# EasyEDA Pro project New Project_2025-05-17_15-31-49.eprj

# Schematic Schematic1
Board Name: Board1; Create Date: 2025-05-17; Page Name: P1; Project Name: New Project_2025-05-17_15-31-49; Schematic Name: Schematic1; Update Date: 2025-05-17; Company: 嘉立创EDA; Page Size: A4; Version: V1.0
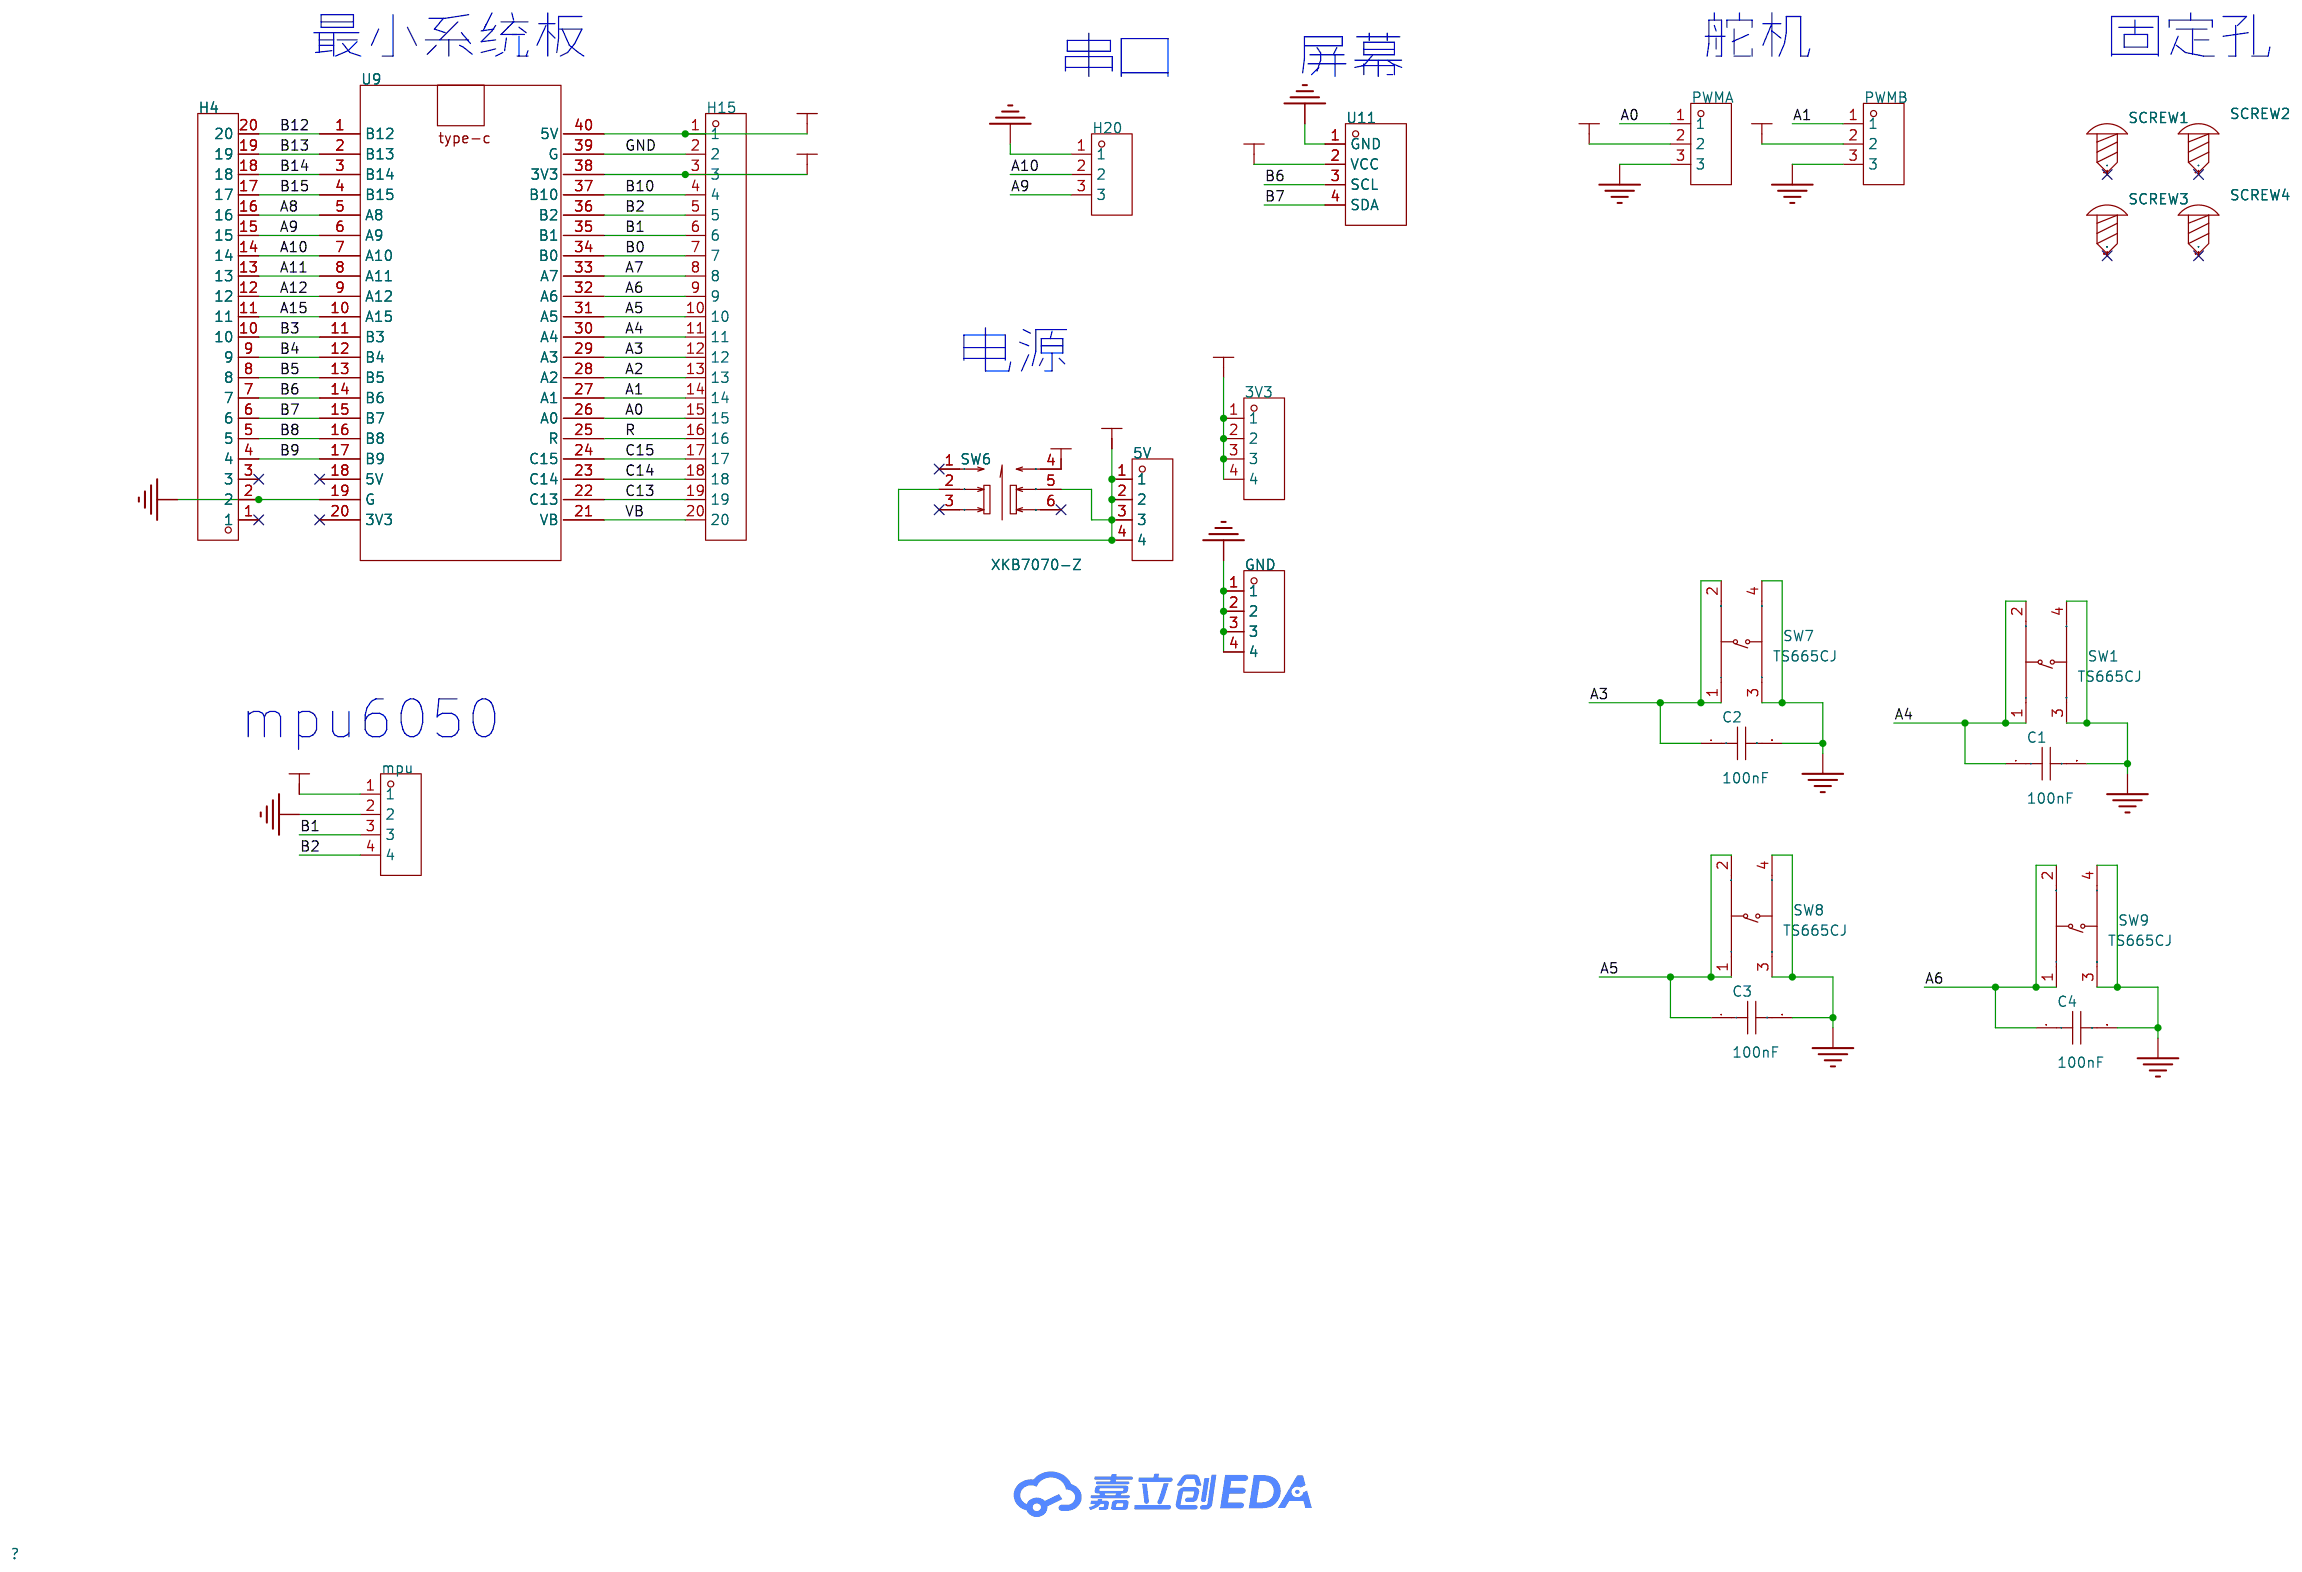
[diagram p0: schematic sheet]

## Parts
3V3  -  [HDR-TH_4P-P2.54-V-M]
5V  -  [HDR-TH_4P-P2.54-V-M]
C1  100nF  [CAP-TH_L5.0-W2.5-P5.00-D1.0]
C2  100nF  [CAP-TH_L5.0-W2.5-P5.00-D1.0]
C3  100nF  [CAP-TH_L5.0-W2.5-P5.00-D1.0]
C4  100nF  [CAP-TH_L5.0-W2.5-P5.00-D1.0]
GND  -  [HDR-TH_4P-P2.54-V-M]
H4  -  [HDR-TH_20P-P2.54-V-M-1]
H15  -  [HDR-TH_20P-P2.54-V-M-1]
H20  -  [HDR-TH_3P-P2.54-V-M]
mpu  -  [HDR-TH_4P-P2.54-V-F]
PWMA  -  [HDR-TH_3P-P2.54-V-M]
PWMB  -  [HDR-TH_3P-P2.54-V-M]
SCREW1  -  [M3螺丝]
SCREW2  -  [M3螺丝]
SCREW3  -  [M3螺丝]
SCREW4  -  [M3螺丝]
SW1  TS665CJ  [SW-TH_4P-L6.0-W6.0-P4.50-LS6.5]
SW6  XKB7070-Z  [SW-TH_6P-L7.0-W7.0-P2.00]
SW7  TS665CJ  [SW-TH_4P-L6.0-W6.0-P4.50-LS6.5]
SW8  TS665CJ  [SW-TH_4P-L6.0-W6.0-P4.50-LS6.5]
SW9  TS665CJ  [SW-TH_4P-L6.0-W6.0-P4.50-LS6.5]
U9  -  [F401CCU6]
U11  HS96L03W2C03  [OLED-TH_L27.8-W27.2-P2.54_C9900033791]

## Library data of the parts
3V3 5V GND = HDR-M_2.54_1x4P: Supplier Part: C492403; Supplier Footprint: 插件
C1-C4 = CC1H104MC1FD3F6C10MF: 容值:100nF;精度:±20%;额定电压:50V;温度系数:Y5V;; LCSC Part Name: 100nF ±20% 50V; Supplier Part: C254085; Manufacturer: Dersonic(德尔创); Supplier Footprint: 插件,P=5.08mm; JLCPCB Part Class: 扩展库; Datasheet: https://atta.szlcsc.com/upload/public/pdf/source/20200826/C254085_159DD65BF32BF11C9168D341BCE23E6F.pdf; Supplier: LCSC; Tolerance: ±20%; Voltage Rating: 50V; Pin Spacing: 5.08mm; Temperature Coefficient: Y5V; Diameter: 6mm; Body Thickness: 2.2mm
H4 H15 = HDR-M_2.54_1x20P: 间距:2.54mm;总PIN位数:20;排数:1;插针结构:-;行距:-;安装类型:直插;圆针/方针:-;额定电流:-;额定电压:-;配合针长度:-;塑高:-;触头材质:黄铜;触头镀层:-;颜色:黑色;; Supplier Part: C50981; Supplier Footprint: 插件
H20 PWMA PWMB = HDR-M_2.54_1x3P: Supplier Part: C2937625; Supplier Footprint: 插件
mpu = HDR-F_2.54_1x4P: Supplier Part: C2718488; Supplier Footprint: 插件
SCREW1-SCREW4 = M3螺丝: Supplier Footprint: 插件
SW1 SW7-SW9 = TS665CJ: 电路结构:单刀单掷;按钮形状:圆形按钮;安装方式:直插;开关长度:6mm;开关宽度:6mm;开关高度:5mm;触点电流:50mA;额定电压(DC):12V;带灯:-;机械寿命:-;; LCSC Part Name: 6*6*5mm 直插 轻触开关; Supplier Part: C393938; Manufacturer: SHOU HAN(首韩); Supplier Footprint: 插件; JLCPCB Part Class: 扩展库; Datasheet: https://atta.szlcsc.com/upload/public/pdf/source/20190521/C393938_BDABEAC600B4C55E200A80AA129B70BC.pdf; Supplier: LCSC; Circuit: 单刀单掷; Actuator Style: 圆形按钮; Mounting Style: 直插; Switch Length: 6mm; Switch Width: 6mm; Switch Height: 5mm; Contact Current: 50mA; Voltage Rating (DC): 12V
SW6 = XKB7070-Z: 自锁/无锁:自锁;安装方式:直插;触点电流:100mA;额定电压 (AC):250V;额定电压 (DC):30V;带灯:不带;作用力:160gf;机械寿命:10万次;; LCSC Part Name: 按键开关   7*7插件自锁 蓝白黑; Supplier Part: C318863; Manufacturer: XKB Connectivity(中国星坤); Supplier Footprint: 插件; Datasheet: https://atta.szlcsc.com/upload/public/pdf/source/20211015/75A682A27A424BDE8D93C2CFA14C38FE.pdf; Supplier: LCSC; Self Lock / No Lock: 自锁; Actuator Style: 矩形按钮; Mounting Style: 直插; Contact Current: 100mA; Voltage Rating (AC): 250V; Voltage Rating (DC): 30V; Insulation Resistance: 100MΩ; Actuator/Cap Color: 蓝色; With Lamp: 不带; Pin Style: PC引脚; Operating Force: 160gf; Operating Temperature: -15℃~+55℃; Mechanical Life: 10万次
U9 = F401CCU6
U11 = HS96L03W2C03: 主控芯片:SSD1315;接口类型:I2C;尺寸(inch):0.96;像素分辨率:128x64;; LCSC Part Name: 0.96寸OLED显示屏窄白光IIC; Supplier Part: C5248080; Manufacturer: HS(汉昇); JLCPCB Part Class: 扩展库; Datasheet: https://atta.szlcsc.com/upload/public/pdf/source/20230627/763D01F79A90007632F098068C7C8AD9.pdf; Supplier: LCSC; Main Control Chip: SSD1315; Interface Type: I2C; Size: 0.96; Pixel Resolution: 128x64; Operating Temperature: -40℃~+70℃

## Nets
3V3: 3V3.1 3V3.2 3V3.3 3V3.4 H15.3 U9.38(3V3) U11.2(VCC)
5V: 5V.1 5V.2 5V.3 5V.4 H15.1 mpu.1 PWMA.2 PWMB.2 SW6.2 SW6.4 SW6.5 U9.40(5V)
GND: C1.2 C2.2 C3.2 C4.2 GND.1 GND.2 GND.3 GND.4 H4.2 H15.2 H20.1 mpu.2 PWMA.3 PWMB.3 SW1.3(C) SW1.4(D) SW7.3(C) SW7.4(D) SW8.3(C) SW8.4(D) SW9.3(C) SW9.4(D) U9.19(G) U9.39(G) U11.1(GND)
A0: H15.15 PWMA.1 U9.26(A0)
A1: H15.14 PWMB.1 U9.27(A1)
A2: H15.13 U9.28(A2)
A3: C2.1 H15.12 SW7.1(A) SW7.2(B) U9.29(A3)
A4: C1.1 H15.11 SW1.1(A) SW1.2(B) U9.30(A4)
A5: C3.1 H15.10 SW8.1(A) SW8.2(B) U9.31(A5)
A6: C4.1 H15.9 SW9.1(A) SW9.2(B) U9.32(A6)
A7: H15.8 U9.33(A7)
A8: H4.16 U9.5(A8)
A9: H4.15 H20.3 U9.6(A9)
A10: H4.14 H20.2 U9.7(A10)
A11: H4.13 U9.8(A11)
A12: H4.12 U9.9(A12)
A15: H4.11 U9.10(A15)
B0: H15.7 U9.34(B0)
B1: H15.6 mpu.3 U9.35(B1)
B2: H15.5 mpu.4 U9.36(B2)
B3: H4.10 U9.11(B3)
B4: H4.9 U9.12(B4)
B5: H4.8 U9.13(B5)
B6: H4.7 U9.14(B6) U11.3(SCL)
B7: H4.6 U9.15(B7) U11.4(SDA)
B8: H4.5 U9.16(B8)
B9: H4.4 U9.17(B9)
B10: H15.4 U9.37(B10)
B12: H4.20 U9.1(B12)
B13: H4.19 U9.2(B13)
B14: H4.18 U9.3(B14)
B15: H4.17 U9.4(B15)
C13: H15.19 U9.22(C13)
C14: H15.18 U9.23(C14)
C15: H15.17 U9.24(C15)
R: H15.16 U9.25(R)
VB: H15.20 U9.21(VB)

Not connected (* = marked no-connect by the designer): H4 1* 3*; SCREW1 1*; SCREW2 1*; SCREW3 1*; SCREW4 1*; SW6 1* 3* 6*; U9 18(5V)* 20(3V3)*

## Notes on the sheet
- 最小系统板
- 舵机
- 固定孔
- 串口
- 屏幕
- 电源
- mpu6050

# Board PCB1
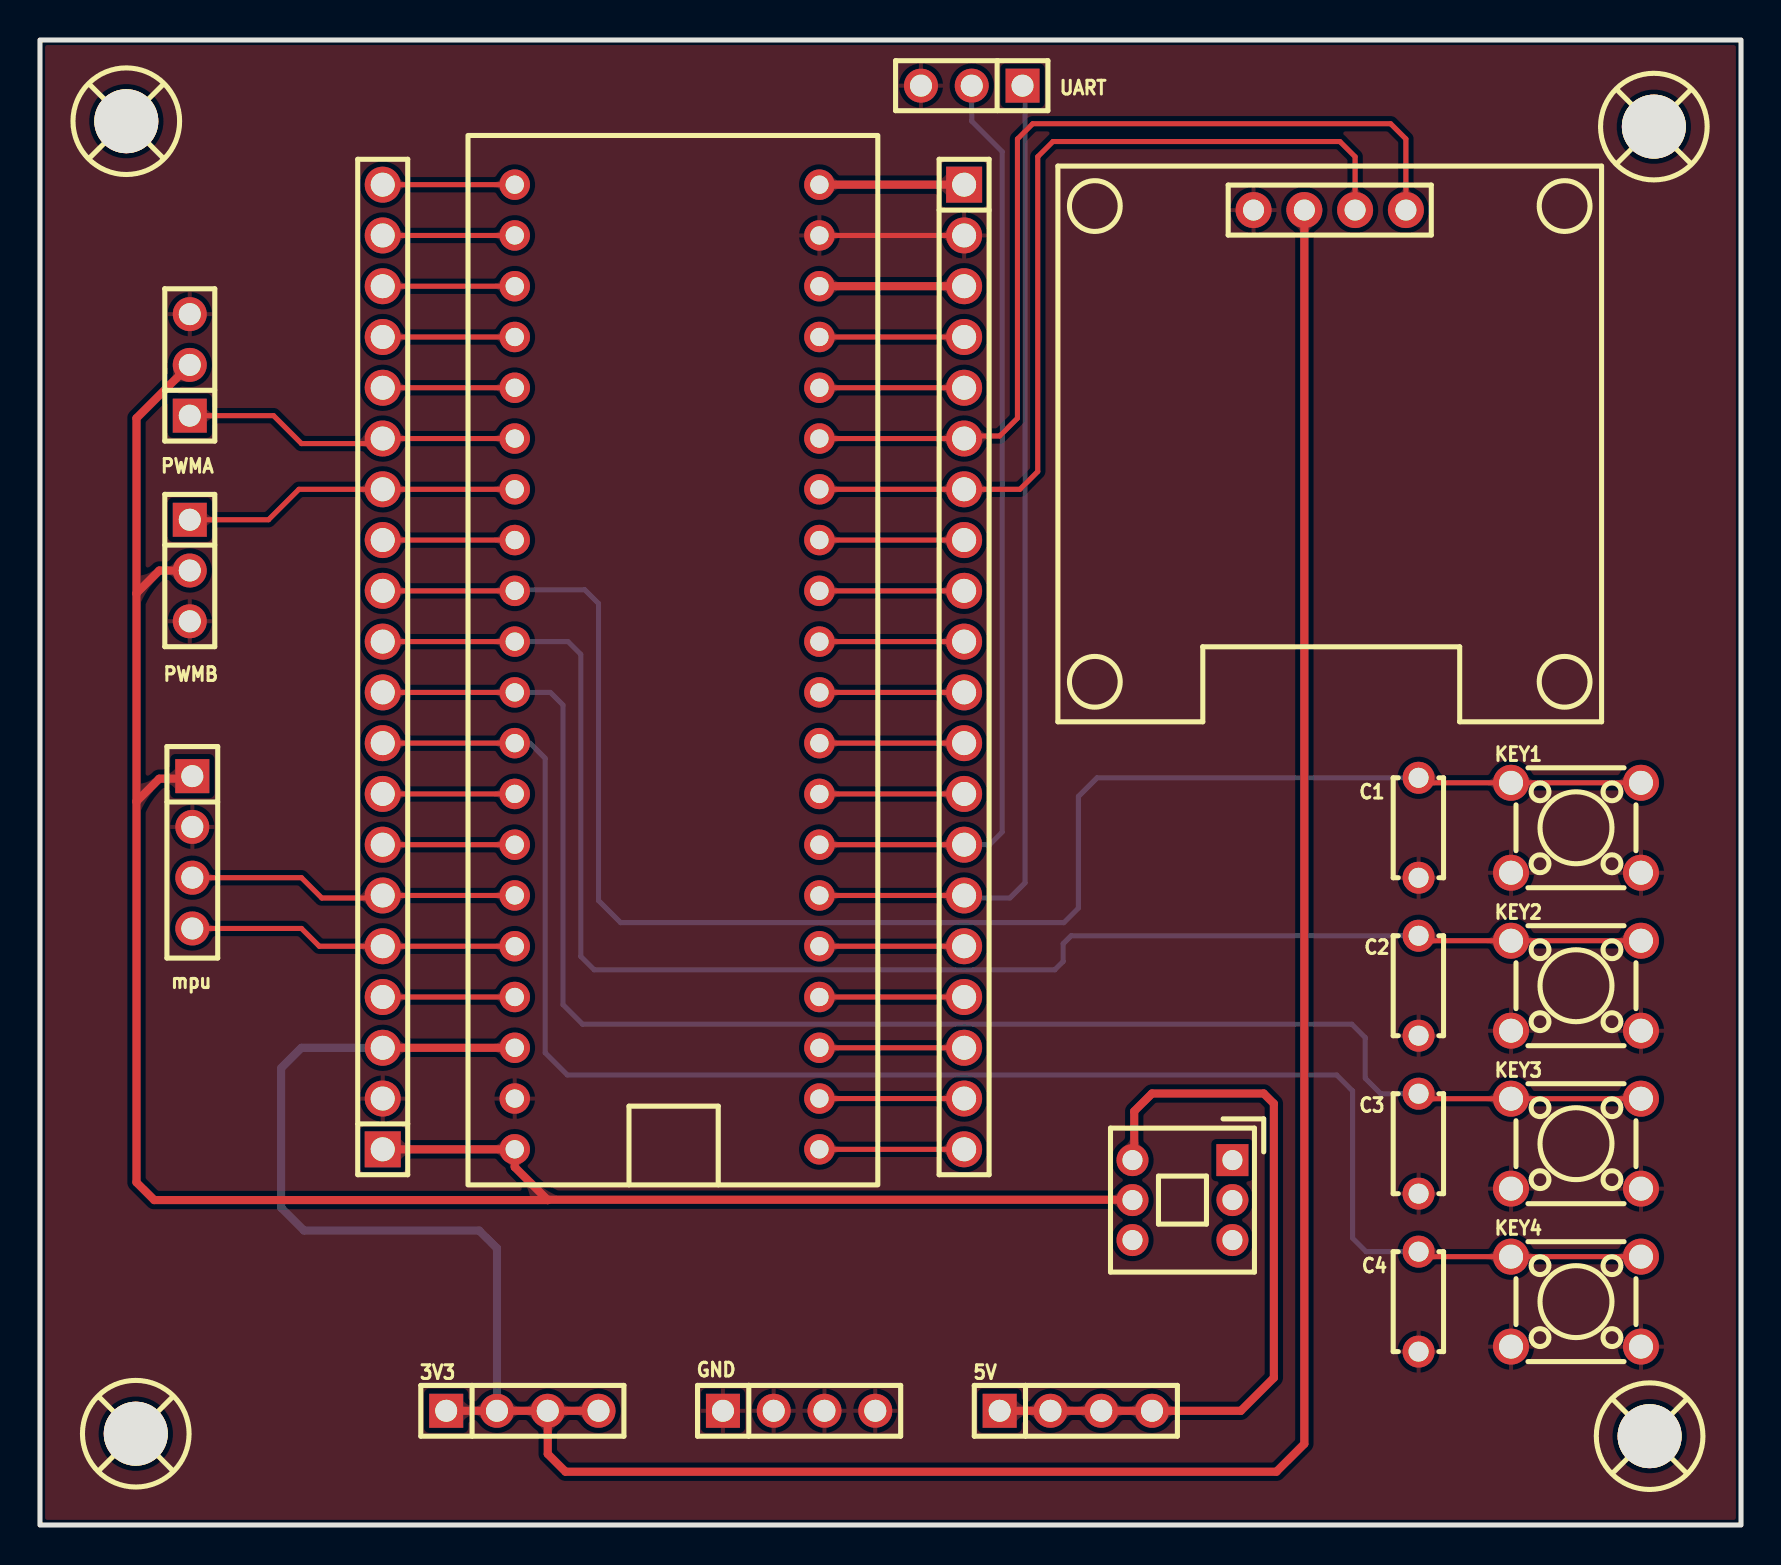
[diagram p1: board, top side]
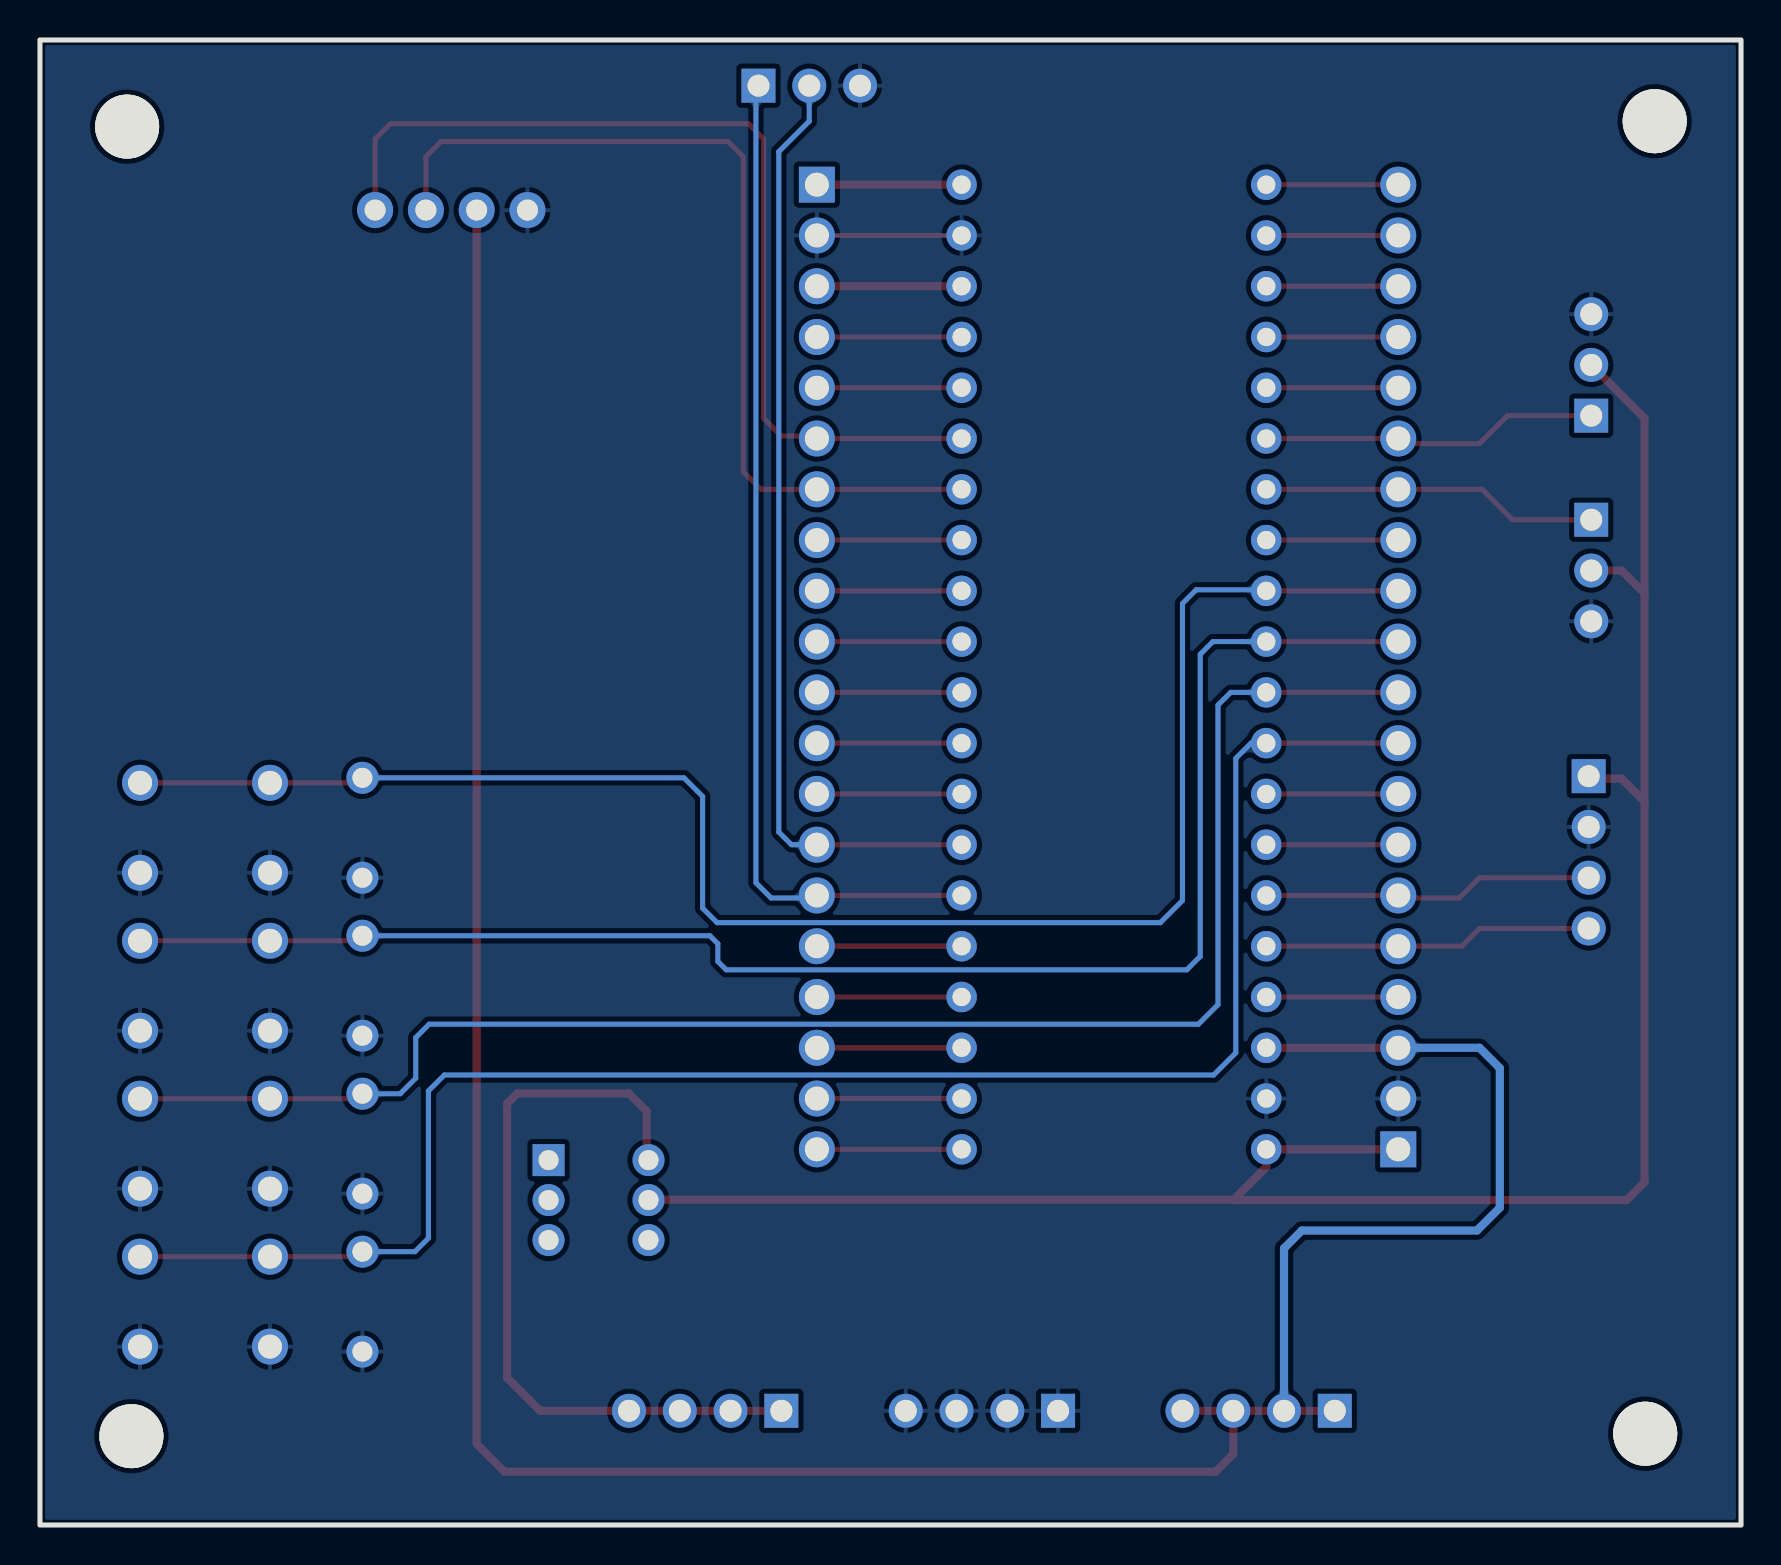
[diagram p2: board, bottom side, seen from below]

Outline 85.09 x 74.3 mm; copper layers: Top Layer, Bottom Layer. Coordinates in mm from the lower left corner of the outline.
Outline path: rectangle 0,74.3 85.09,0
Stack: Top Layer 0.035mm / Dielectric1 1.51mm FR4 er 4.5 / Bottom Layer 0.035mm

## Design rules (mm)
template: JLCPCB Capability(Two Layers Board)
spacing copperThickness1oz (default): track to track 0.102, other pairs 0.152 to 0.3
spacing copperThickness2oz: track to track 0.203, other pairs 0.152 to 0.3
track width copperThickness1oz (default): min 0.127, default 0.254, max 2.54
track width copperThickness2oz: min 0.203, default 0.254, max 2.54
differential pair differentialPair (default): width min 0.127, default 0.254, max 2.54; gap min 0.152, default 0.152
via viaSize (default): diameter min 0.5, default 0.61, max 10; hole min 0.3, default 0.305, max 6.3

## Placement (name value [footprint] x y rotation side)
3V3  -  [HDR-TH_4P-P2.54-V-M]  24.13 5.72 0 top
5V  -  [HDR-TH_4P-P2.54-V-M]  51.82 5.72 0 top
C1  100nF  [CAP-TH_L5.0-W2.5-P5.00-D1.0]  68.96 34.88 270 top
C2  100nF  [CAP-TH_L5.0-W2.5-P5.00-D1.0]  68.96 26.98 270 top
C3  100nF  [CAP-TH_L5.0-W2.5-P5.00-D1.0]  68.96 19.08 270 top
C4  100nF  [CAP-TH_L5.0-W2.5-P5.00-D1.0]  68.96 11.18 270 top
GND  -  [HDR-TH_4P-P2.54-V-M]  37.97 5.72 0 top
H4  -  [HDR-TH_20P-P2.54-V-M-1]  46.23 42.93 270 top
H15  -  [HDR-TH_20P-P2.54-V-M-1]  17.14 42.93 90 top
KEY1  TS665CJ  [SW-TH_4P-L6.0-W6.0-P4.50-LS6.5]  76.83 34.88 0 top
KEY2  TS665CJ  [SW-TH_4P-L6.0-W6.0-P4.50-LS6.5]  76.83 26.98 0 top
KEY3  TS665CJ  [SW-TH_4P-L6.0-W6.0-P4.50-LS6.5]  76.83 19.08 0 top
KEY4  TS665CJ  [SW-TH_4P-L6.0-W6.0-P4.50-LS6.5]  76.83 11.18 0 top
mpu  -  [HDR-TH_4P-P2.54-V-F]  7.62 33.66 270 top
PWMA  -  [HDR-TH_3P-P2.54-V-M]  7.49 58.04 90 top
PWMB  -  [HDR-TH_3P-P2.54-V-M]  7.49 47.75 270 top
SCREW1  -  [M3螺丝]  4.32 70.23 0 top
SCREW2  -  [M3螺丝]  80.73 69.96 0 top
SCREW3  -  [M3螺丝]  4.79 4.57 0 top
SCREW4  -  [M3螺丝]  80.52 4.44 0 top
SW6  XKB7070-Z  [SW-TH_6P-L7.0-W7.0-P2.00]  57.15 16.26 0 top
U9  -  [F401CCU6]  38.99 18.8 180 top
U11  HS96L03W2C03  [OLED-TH_L27.8-W27.2-P2.54_C9900033791]  64.52 65.79 0 top
UART  -  [HDR-TH_3P-P2.54-V-M]  46.61 72.01 180 top

## Footprints (pads in the part's own frame, mm; a bottom-side part is the same pattern mirrored in y, then rotated)
CAP-TH_L5.0-W2.5-P5.00-D1.0
  round 1.6 hole 1: 1(-2.5,0) 2(2.5,0)
F401CCU6
  round 1.524 hole 0.914: 1(0,0) 2(0,-2.54) 3(0,-5.08) 4(0,-7.62) 5(0,-10.16) 6(0,-12.7) 7(0,-15.24) 8(0,-17.78) 9(0,-20.32) 10(0,-22.86) 11(0,-25.4) 12(0,-27.94) 13(0,-30.48) 14(0,-33.02) 15(0,-35.56) 16(0,-38.1) 17(0,-40.64) 18(0,-43.18) 19(0,-45.72) 20(0,-48.26) 21(15.24,-48.26) 22(15.24,-45.72) 23(15.24,-43.18) 24(15.24,-40.64) 25(15.24,-38.1) 26(15.24,-35.56) 27(15.24,-33.02) 28(15.24,-30.48) 29(15.24,-27.94) 30(15.24,-25.4) 31(15.24,-22.86) 32(15.24,-20.32) 33(15.24,-17.78) 34(15.24,-15.24) 35(15.24,-12.7) 36(15.24,-10.16) 37(15.24,-7.62) 38(15.24,-5.08) 39(15.24,-2.54) 40(15.24,0)
HDR-TH_3P-P2.54-V-M
  rect 1.7x1.7 hole 1.1: 1(-2.54,0)
  round 1.7 hole 1.1: 2(0,0) 3(2.54,0)
HDR-TH_4P-P2.54-V-F
  rect 1.7x1.7 hole 1.1: 1(-3.81,0)
  round 1.7 hole 1.1: 2(-1.27,0) 3(1.27,0) 4(3.81,0)
HDR-TH_4P-P2.54-V-M
  rect 1.7x1.7 hole 1.1: 1(-3.81,0)
  round 1.7 hole 1.1: 2(-1.27,0) 3(1.27,0) 4(3.81,0)
HDR-TH_20P-P2.54-V-M-1
  rect 1.8x1.8 hole 1.2: 1(-24.13,0)
  round 1.8 hole 1.2: 2(-21.59,0) 3(-19.05,0) 4(-16.51,0) 5(-13.97,0) 6(-11.43,0) 7(-8.89,0) 8(-6.35,0) 9(-3.81,0) 10(-1.27,0) 11(1.27,0) 12(3.81,0) 13(6.35,0) 14(8.89,0) 15(11.43,0) 16(13.97,0) 17(16.51,0) 18(19.05,0) 19(21.59,0) 20(24.13,0)
M3螺丝
  round 3.2 hole 3.2: 1(0,0)
OLED-TH_L27.8-W27.2-P2.54_C9900033791
  round 1.8 hole 1.05: 1(-3.81,0) 2(-1.27,0) 3(1.27,0) 4(3.81,0)
SW-TH_4P-L6.0-W6.0-P4.50-LS6.5
  round 1.8 hole 1.2: 1(-3.25,2.25) 2(3.25,2.25) 3(-3.25,-2.25) 4(3.25,-2.25)
SW-TH_6P-L7.0-W7.0-P2.00
  rect 1.6x1.6 hole 1: 1(2.499,2)
  round 1.6 hole 1: 2(2.5,0) 3(2.5,-2) 4(-2.5,2) 5(-2.5,0) 6(-2.5,-2)

## Nets
As in the schematic, except:
GND: C1.2 C2.2 C3.2 C4.2 GND.1 GND.2 GND.3 GND.4 H4.2 H15.2 KEY1.3 KEY1.4 KEY2.3 KEY2.4 KEY3.3 KEY3.4 KEY4.3 KEY4.4 mpu.2 PWMA.3 PWMB.3 U9.19 U9.39 U11.1 UART.3
A3: C1.1 H15.12 KEY1.1 KEY1.2 U9.29
A4: C2.1 H15.11 KEY2.1 KEY2.2 U9.30
A5: C3.1 H15.10 KEY3.1 KEY3.2 U9.31
A6: C4.1 H15.9 KEY4.1 KEY4.2 U9.32
A9: H4.15 U9.6 UART.1
A10: H4.14 U9.7 UART.2

Pads without a net: H4 1 3; SCREW1 1; SCREW2 1; SCREW3 1; SCREW4 1; SW6 1 3 6; U9 18 20

## Routing (per net, layer and track width the routed paths; a pad name or vN(x,y) marks a point on that pad's centre or on a via; arc(x,y) is an arc through that point)
3V3: length 149.1
  Top Layer w0.406: 25.4,5.72 3V3.2 3V3.1 ; 25.4,5.72 25.4,3.56 26.29,2.67 61.85,2.67 63.25,4.06 U11.2 ; 25.4,5.72 3V3.4 ; U9.38 H15.3
  Bottom Layer w0.406: 3V3.2 22.86,13.84 21.97,14.73 13.21,14.73 12.06,15.88 12.06,22.86 13.08,23.88 H15.3
5V: length 146.7
  Top Layer w0.406: 4.83,36.2 4.83,46.61 ; 4.83,36.2 4.83,17.15 5.72,16.26 25.4,16.26 ; 4.83,36.2 5.97,37.34 7.49,37.34 mpu.1 ; 4.83,46.61 4.83,55.37 PWMA.2 ; 4.83,46.61 5.97,47.75 PWMB.2 ; SW6.4 54.74,18.34 54.74,20.7 55.63,21.59 61.21,21.59 61.72,21.08 61.72,7.37 60.07,5.72 5V.4 5V.3 5V.1 ; SW6.5 54.63,16.27 25.42,16.27 25.4,16.26 ; 25.4,16.26 23.75,17.91 U9.40 H15.1
GND: length 7.2
  Top Layer w0.254: U9.19 H4.2
(no net): length 14.5
  Top Layer w0.406: 38.99,61.98 46.23,61.98 ; U9.20 46.23,67.06
A0: length 16.9
  Top Layer w0.254: U9.26 17.14,54.36 16.89,54.1 13.08,54.1 11.68,55.5 PWMA.1
A1: length 16.9
  Top Layer w0.254: U9.27 H15.14 12.95,51.82 11.43,50.29 PWMB.1
A2: length 6.6
  Top Layer w0.254: 17.14,49.28 U9.28
A3: length 84.9
  Top Layer w0.254: KEY1.2 KEY1.1 69.21,37.13 C1.1 ; H15.12 U9.29
  Bottom Layer w0.254: U9.29 23.8,46.79 27.25,46.79 27.94,46.1 27.94,31.24 29.05,30.14 51.22,30.14 51.94,30.86 51.94,36.45 52.88,37.38 C1.1
A4: length 79.9
  Top Layer w0.254: KEY2.2 KEY2.1 69.21,29.23 C2.1 ; 17.14,44.2 23.75,44.2
  Bottom Layer w0.254: C2.1 51.58,29.48 51.18,29.08 51.18,28.19 50.76,27.78 27.72,27.78 27.05,28.45 27.05,43.56 26.42,44.2 23.75,44.2
A5: length 81.3
  Top Layer w0.254: KEY3.2 KEY3.1 69.21,21.33 C3.1 ; H15.10 U9.31
  Bottom Layer w0.254: C3.1 67.07,21.58 66.29,22.35 66.29,24.38 65.62,25.06 27.14,25.06 26.16,26.04 26.16,41.02 25.53,41.66 U9.31
A6: length 86.5
  Top Layer w0.254: H15.9 U9.32 ; C4.1 69.21,13.43 KEY4.1 KEY4.2
  Bottom Layer w0.254: C4.1 66.33,13.68 65.66,14.35 65.66,21.72 64.86,22.52 26.38,22.52 25.27,23.62 25.27,38.35 24.51,39.12 U9.32
A7: length 6.6
  Top Layer w0.254: H15.8 U9.33
A8: length 7.2
  Top Layer w0.254: U9.5 H4.16
A9: length 50.6
  Top Layer w0.254: U9.6 H4.15
  Bottom Layer w0.254: H4.15 46.36,31.37 48.51,31.37 49.28,32.13 49.28,71.88 UART.1
A10: length 46.5
  Top Layer w0.254: U9.7 H4.14
  Bottom Layer w0.254: 47.12,34.04 47.5,34.04 48.13,34.67 48.13,68.71 46.61,70.23 UART.2
A11: length 7.2
  Top Layer w0.254: U9.8 H4.13
A12: length 7.2
  Top Layer w0.254: U9.9 H4.12
A15: length 7.2
  Top Layer w0.254: U9.10 H4.11
B0: length 6.6
  Top Layer w0.254: H15.7 U9.34
B1: length 16.6
  Top Layer w0.254: mpu.3 13.08,32.39 14.1,31.37 17.02,31.37 H15.6 U9.35
B2: length 16.5
  Top Layer w0.254: U9.36 H15.5 13.97,28.96 13.08,29.85 mpu.4
B3: length 7.2
  Top Layer w0.254: 38.99,44.2 46.23,44.2
B4: length 7.2
  Top Layer w0.254: U9.12 H4.9
B5: length 7.2
  Top Layer w0.254: U9.13 46.23,49.28
B6: length 46.2
  Top Layer w0.254: U9.14 H4.7 49.02,51.82 49.91,52.71 49.91,68.45 50.67,69.22 65.02,69.22 65.79,68.45 U11.3
B7: length 47.9
  Top Layer w0.254: U9.15 46.23,54.36 46.36,54.48 48.01,54.48 48.89,55.37 48.89,69.34 49.66,70.1 67.56,70.1 68.33,69.34 U11.4
B8: length 7.2
  Top Layer w0.254: U9.16 H4.5
B9: length 7.2
  Top Layer w0.254: U9.17 H4.4
B10: length 6.6
  Top Layer w0.254: U9.37 17.14,26.42
B12: length 7.2
  Top Layer w0.254: U9.1 H4.20
B13: length 7.2
  Top Layer w0.254: U9.2 46.23,21.34
B14: length 7.2
  Top Layer w0.254: U9.3 H4.18
B15: length 7.2
  Top Layer w0.254: U9.4 46.23,26.42
C13: length 6.6
  Top Layer w0.254: H15.19 U9.22
C14: length 6.6
  Top Layer w0.254: 23.75,61.98 17.14,61.98
C15: length 6.6
  Top Layer w0.254: H15.17 U9.24
R: length 6.6
  Top Layer w0.254: H15.16 U9.25
VB: length 6.6
  Top Layer w0.254: 17.14,67.06 U9.21

## Copper pours and planes (outline as drawn; the poured copper is in the pictures)
GND on Top Layer: -6.48,81.41 91.44,81.41 91.44,-6.1 -6.48,-6.1
GND on Bottom Layer: -6.35,81.66 91.19,81.66 91.19,-6.1 -6.35,-6.1

Small or netless copper shapes (teardrops, artwork), in the pictures only: 130 on Top Layer, 14 on Bottom Layer
